# EAGLE design C64_Exp_port (EAGLE 9.6.0)
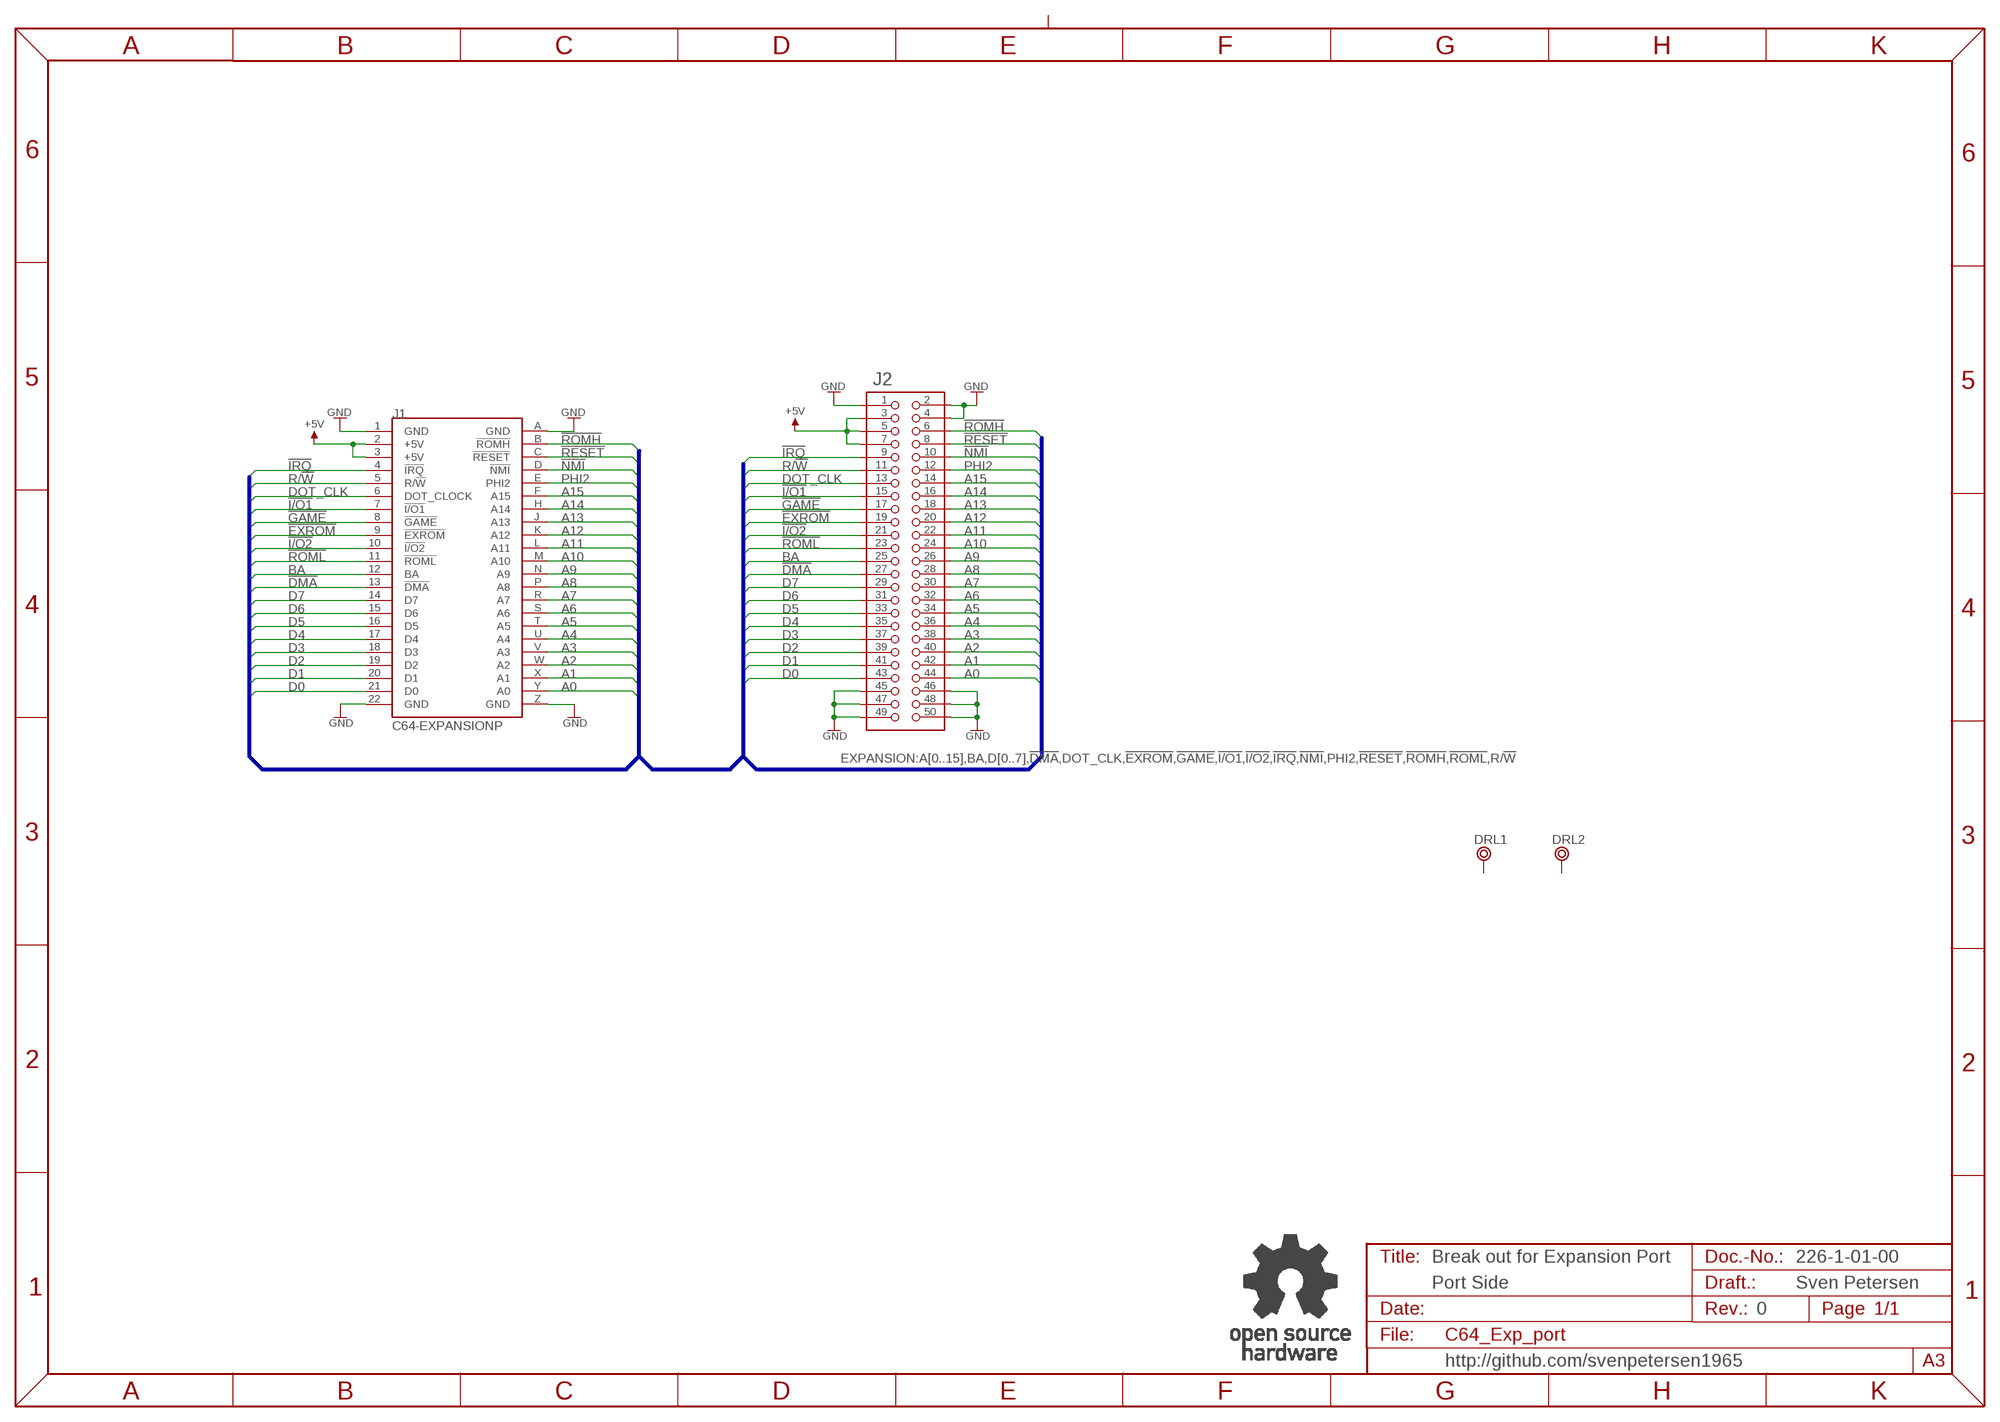
[diagram p0: schematic, sheet 1]

## Parts
DRL1  BOHR3,3  [BOHR3,3]
DRL2  BOHR3,3  [BOHR3,3]
J1  C64-EXPANSIONP  [EXPPORT]
J2  PINHD-2X25BOX  [2X25WV]
U$22  OPEN_SOURCE_HW  [OPENHW]

## Nets
!DMA: J1.13(!DMA) J2.27
!EXROM: J1.9(!EXROM) J2.19
!GAME: J1.8(!GAME) J2.17
!I/O1: J1.7(!I/O1) J2.15
!I/O2: J1.10(!I/O2) J2.21
!IRQ: J1.4(!IRQ) J2.9
!NMI: J1.D(!NMI) J2.10
!RESET: J1.C(!RESET) J2.8
!ROMH: J1.B(!ROMH) J2.6
!ROML: J1.11(!ROML) J2.23
+5V: J1.2(+5V) J1.3(+5V) J2.3 J2.5 J2.7
A0: J1.Y(A0) J2.44
A1: J1.X(A1) J2.42
A2: J1.W(A2) J2.40
A3: J1.V(A3) J2.38
A4: J1.U(A4) J2.36
A5: J1.T(A5) J2.34
A6: J1.S(A6) J2.32
A7: J1.R(A7) J2.30
A8: J1.P(A8) J2.28
A9: J1.N(A9) J2.26
A10: J1.M(A10) J2.24
A11: J1.L(A11) J2.22
A12: J1.K(A12) J2.20
A13: J1.J(A13) J2.18
A14: J1.H(A14) J2.16
A15: J1.F(A15) J2.14
BA: J1.12(BA) J2.25
D0: J1.21(D0) J2.43
D1: J1.20(D1) J2.41
D2: J1.19(D2) J2.39
D3: J1.18(D3) J2.37
D4: J1.17(D4) J2.35
D5: J1.16(D5) J2.33
D6: J1.15(D6) J2.31
D7: J1.14(D7) J2.29
DOT_CLK: J1.6(DOT_CLOCK) J2.13
GND: J1.1(GND) J1.22(GND) J1.A(GND) J1.Z(GND) J2.1 J2.2 J2.4 J2.45 J2.46 J2.47 J2.48 J2.49 J2.50
PHI2: J1.E(PHI2) J2.12
R/!W: J1.5(R/!W) J2.11
Unconnected: DRL1.P$1 DRL2.P$1

## Buses
EXPANSION:A[0..15],BA,D[0..7],!DMA,DOT_CLK,!EXROM,!GAME,!I/O1,!I/O2,!IRQ,!NMI,PHI2,!RESET,!ROMH,!ROML,R/!W

## Notes on the sheet
- Break out for Expansion Port | 226-1-01-00
- Port Side | Sven Petersen
- 0
- http://github.com/svenpetersen1965

## Library data of the parts
DRL1 DRL2 = Mech_Bohr:BOHR3,3
J1 = Commodore:C64-EXPANSIONP
J2 = PINHEAD:PINHD-2X25
U$22 = Logo:OPEN_SOURCE_HW

## Board
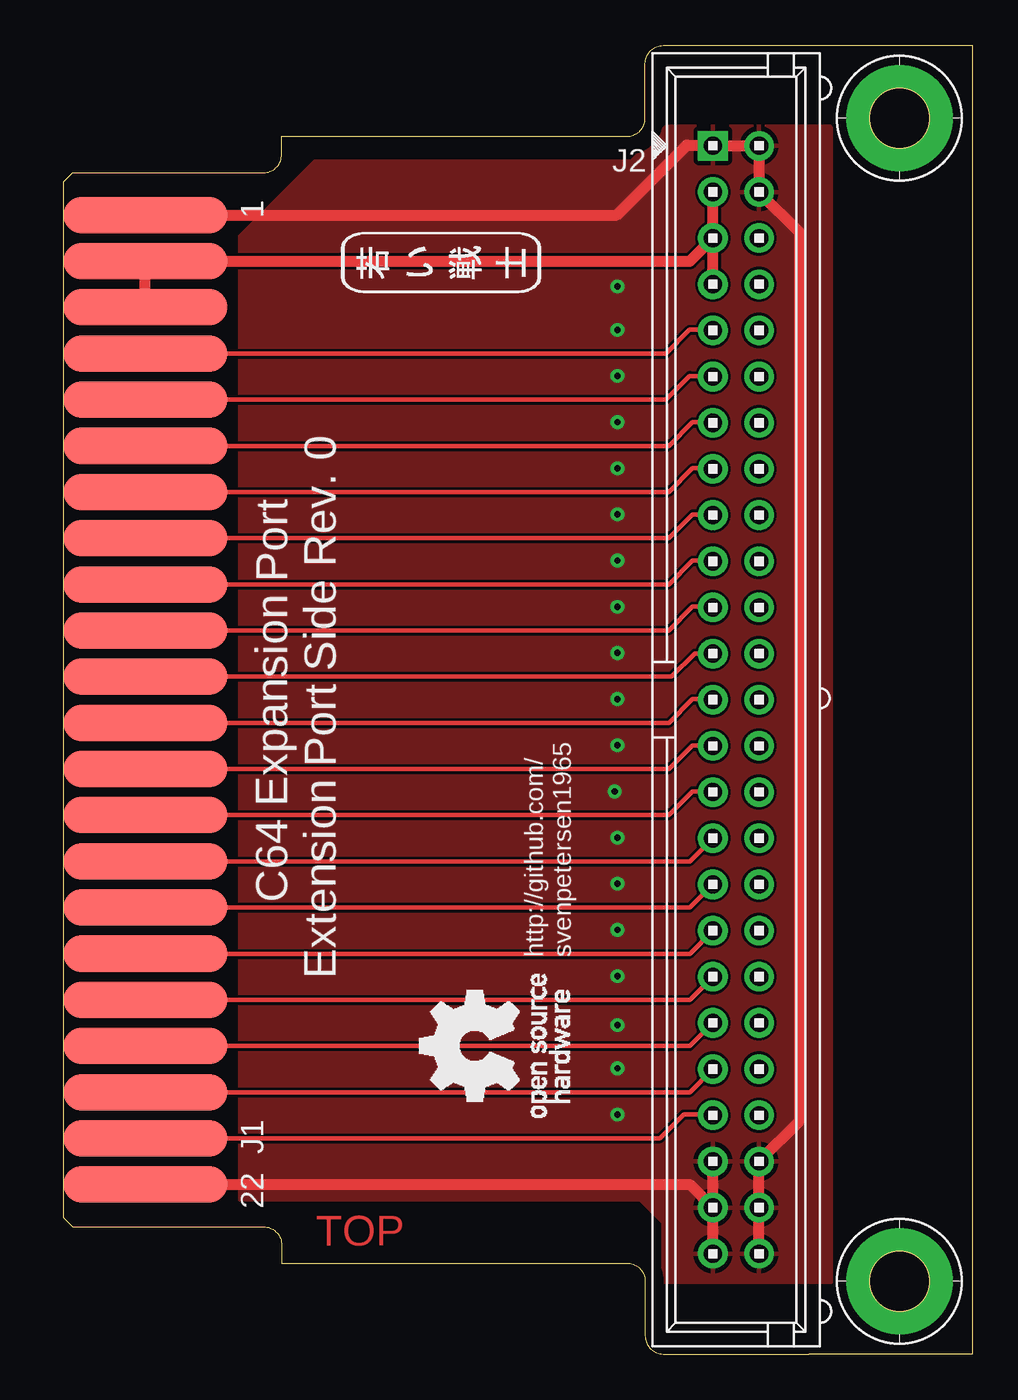
[diagram p1: board, top side]
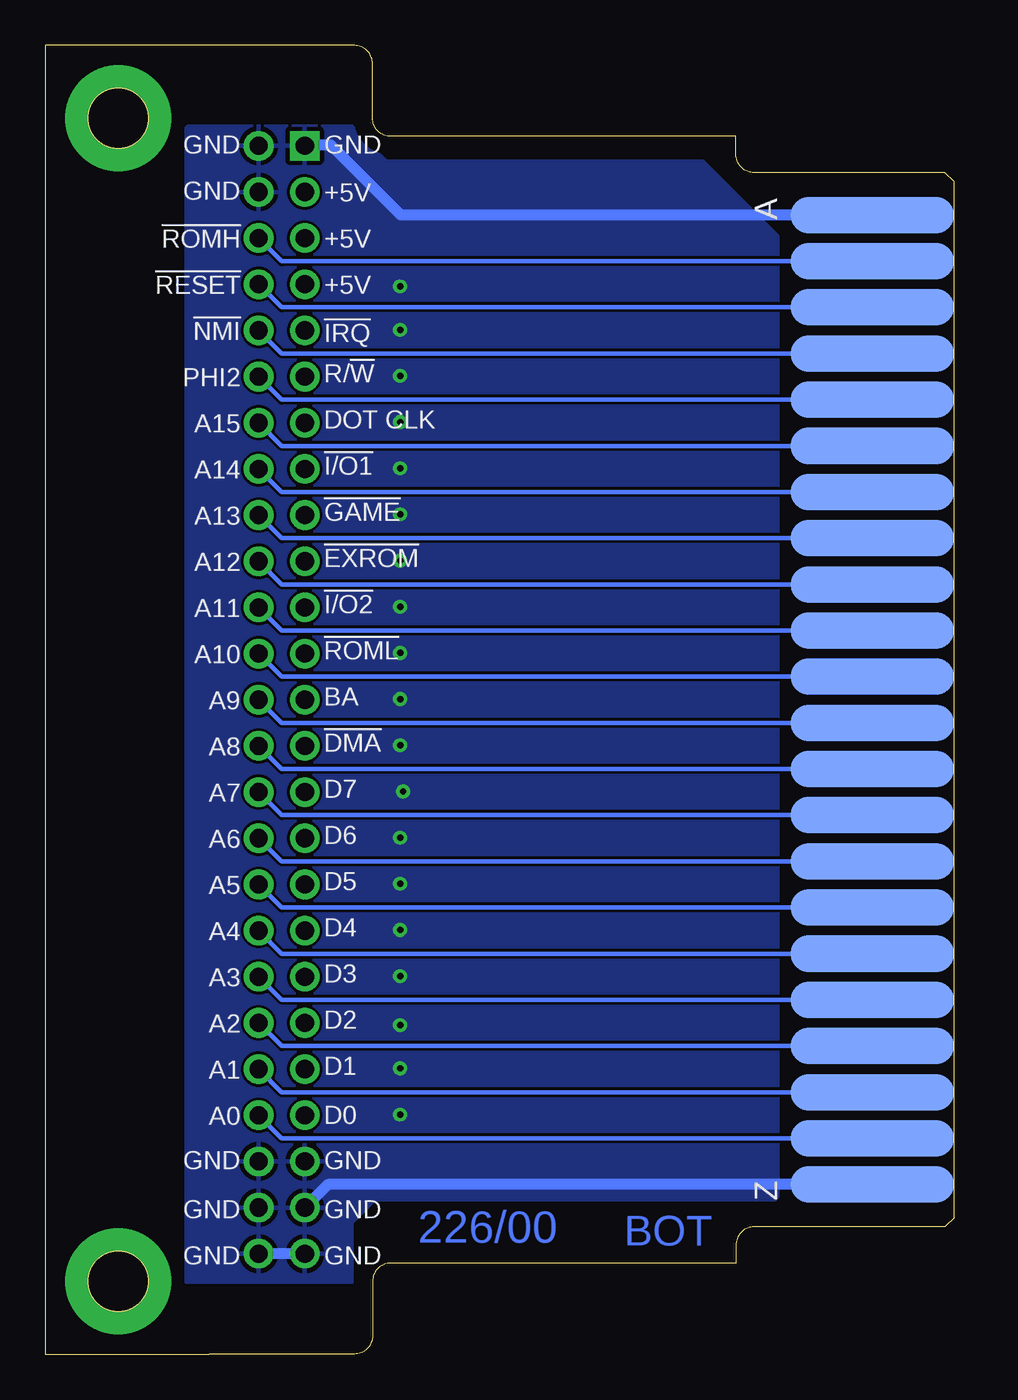
[diagram p2: board, bottom side, seen from below]

Size 50 x 72 mm. Coordinates in mm from the lower left corner, seen from the top.
Outline: 11,7 arc-90 12,6 12,5 31,5 arc-90 32,4 32,1 arc90 33,0 41,0 50,0 50,72 41,72 33,72 arc90 32,71 32,68 arc-90 31,67 12,67 12,66 arc-90 11,65
Copper layers (1*16): Top 0.035mm / dielectric 1.5mm / Bottom 0.035mm
Design rules "default *": minimum track width 6mil, minimum drill 0.35mm, track to track 6mil, track to pad 6mil, pad to pad 6mil, via to via 6mil, smd to smd 6mil, copper to edge 40mil, drill to drill 6mil, minimum pad ring 10mil, minimum via ring 8mil, stop-mask expansion 4mil, vias tented up to drill 25mil, thermal gap 10mil

### Footprints (pad centres in the part's own frame; a part is rotated, then mirrored left to right if it is on the bottom)
BOHR3,3 = drill 3.302 pad 5.842: P$1 0,0
EXPPORT = smd 2 x 9: 1 26.67,-4.5; 2 24.13,-4.5; 3 21.59,-4.5; 4 19.05,-4.5; 5 16.51,-4.5; 6 13.97,-4.5; 7 11.43,-4.5; 8 8.89,-4.5; 9 6.35,-4.5; 10 3.81,-4.5; 11 1.27,-4.5; 12 -1.27,-4.5; 13 -3.81,-4.5; 14 -6.35,-4.5; 15 -8.89,-4.5; 16 -11.43,-4.5; 17 -13.97,-4.5; 18 -16.51,-4.5; 19 -19.05,-4.5; 20 -21.59,-4.5; 21 -24.13,-4.5; 22 -26.67,-4.5 | smd 2 x 9 bottom: A 26.67,-4.5; B 24.13,-4.5; C 21.59,-4.5; D 19.05,-4.5; E 16.51,-4.5; F 13.97,-4.5; H 11.43,-4.5; J 8.89,-4.5; K 6.35,-4.5; L 3.81,-4.5; M 1.27,-4.5; N -1.27,-4.5; P -3.81,-4.5; R -6.35,-4.5; S -8.89,-4.5; T -11.43,-4.5; U -13.97,-4.5; V -16.51,-4.5; W -19.05,-4.5; X -21.59,-4.5; Y -24.13,-4.5; Z -26.67,-4.5
2X25WV = drill 1 pad 1.626 square: 1 -30.48,-1.27 | drill 1 pad 1.626: 2 -30.48,1.27; 3 -27.94,-1.27; 4 -27.94,1.27; 5 -25.4,-1.27; 6 -25.4,1.27; 7 -22.86,-1.27; 8 -22.86,1.27; 9 -20.32,-1.27; 10 -20.32,1.27; 11 -17.78,-1.27; 12 -17.78,1.27; 13 -15.24,-1.27; 14 -15.24,1.27; 15 -12.7,-1.27; 16 -12.7,1.27; 17 -10.16,-1.27; 18 -10.16,1.27; 19 -7.62,-1.27; 20 -7.62,1.27; 21 -5.08,-1.27; 22 -5.08,1.27; 23 -2.54,-1.27; 24 -2.54,1.27; 25 0,-1.27; 26 0,1.27; 27 2.54,-1.27; 28 2.54,1.27; 29 5.08,-1.27; 30 5.08,1.27; 31 7.62,-1.27; 32 7.62,1.27; 33 10.16,-1.27; 34 10.16,1.27; 35 12.7,-1.27; 36 12.7,1.27; 37 15.24,-1.27; 38 15.24,1.27; 39 17.78,-1.27; 40 17.78,1.27; 41 20.32,-1.27; 42 20.32,1.27; 43 22.86,-1.27; 44 22.86,1.27; 45 25.4,-1.27; 46 25.4,1.27; 47 27.94,-1.27; 48 27.94,1.27; 49 30.48,-1.27; 50 30.48,1.27

### Placement (x,y rotation side)
DRL1  46,68 0 top
DRL2  46,4 0 top
J1  0,36 90 top
J2  37,36 270 top
U$20  [2LAYER]  13.88,5.95 0 top
U$21  [PCB-TITLE/]  0,78.74 0 top  (outside the outline)
U$22  27.85,13.02 90 top
U$23  [SVEN_TAG]  20.66,60.09 90 top

### Tracks (layer width: path | path; a pad name or v marks a point on that pad's centre or on a via)
!DMA
  Top 0.254: J1.13 33.3,32.19 34.61,33.5 35.69,33.5 J2.27
!EXROM
  Top 0.254: J1.9 33.3,42.35 34.61,43.66 35.69,43.66 J2.19
!GAME
  Top 0.254: J1.8 33.3,44.89 34.61,46.2 35.69,46.2 J2.17
!I/O1
  Top 0.254: J1.7 33.3,47.43 34.61,48.74 35.69,48.74 J2.15
!I/O2
  Top 0.254: J1.10 33.3,39.81 34.61,41.12 35.69,41.12 J2.21
!IRQ
  Top 0.254: J1.4 33.14,55.05 34.45,56.36 35.69,56.36 J2.9
!NMI
  Bottom 0.254: J1.D 37,55.05 J2.10
!RESET
  Bottom 0.254: J1.C 37,57.59 J2.8
!ROMH
  Bottom 0.254: J1.B 37,60.13 J2.6
!ROML
  Top 0.254: J1.11 33.46,37.27 34.73,38.54 J2.23
+5V
  Top 0.61: J2.5 34.46,60.13 J1.2 J1.3 | J2.5 J2.3 | J2.7 J2.5
A0
  Bottom 0.254: J1.Y 37,11.87 J2.44
A1
  Bottom 0.254: J1.X 37,14.41 J2.42
A2
  Bottom 0.254: J1.W 37,16.95 J2.40
A3
  Bottom 0.254: J1.V 37,19.49 J2.38
A4
  Bottom 0.254: J1.U 37,22.03 J2.36
A5
  Bottom 0.254: J1.T 37,24.57 J2.34
A6
  Bottom 0.254: J1.S 37,27.11 J2.32
A7
  Bottom 0.254: J1.R 37,29.65 J2.30
A8
  Bottom 0.254: J1.P 37,32.19 J2.28
A9
  Bottom 0.254: J1.N 37,34.73 J2.26
A10
  Bottom 0.254: J1.M 37,37.27 J2.24
A11
  Bottom 0.254: J1.L 37,39.81 J2.22
A12
  Bottom 0.254: J1.K 37,42.35 J2.20
A13
  Bottom 0.254: J1.J 37,44.89 J2.18
A14
  Bottom 0.254: J1.H 37,47.43 J2.16
A15
  Bottom 0.254: J1.F 37,49.97 J2.14
BA
  Top 0.254: J1.12 33.3,34.73 34.61,36.04 35.69,36.04 J2.25
D0
  Top 0.152: 35.69,13.18 J2.43
  Top 0.254: J1.21 32.83,11.87 34.13,13.18 35.69,13.18
D1
  Top 0.254: J1.20 34.46,14.41 J2.41
D2
  Top 0.254: J1.19 34.46,16.95 J2.39
D3
  Top 0.254: J1.18 34.46,19.49 J2.37
D4
  Top 0.254: J1.17 34.46,22.03 J2.35
D5
  Top 0.254: J1.16 34.46,24.57 J2.33
D6
  Top 0.254: J1.15 34.46,27.11 J2.31
D7
  Top 0.254: J1.14 33.3,29.65 34.61,30.96 35.69,30.96 J2.29
DOT_CLK
  Top 0.254: J1.6 33.3,49.97 34.61,51.28 35.69,51.28 J2.13
GND  (via drill 0.35)
  Top 0.61: J1.A 30.44,62.67 34.29,66.52 35.69,66.52 J2.1 J2.2 J2.4 40.48,61.73 40.48,12.81 J2.46 J2.48 J2.50 | J1.Z 34.46,9.33 J2.47 | J2.47 J2.45 | J2.49 J2.47
  Bottom 0.61: J2.49 J2.50 | J1.A 30.44,62.67 34.29,66.52 35.69,66.52 J2.1 | J1.Z 34.46,9.33 J2.47
  other vias: 30.48,13.18 30.48,15.72 30.48,18.1 30.48,20.8 30.48,23.34 30.48,25.88 30.48,28.42 30.32,30.96 30.48,33.5 30.48,36.04 30.48,38.58 30.48,41.12 30.48,43.66 30.48,46.2 30.48,48.74 30.48,51.28 30.48,53.82 30.48,56.36 30.48,58.74
  pour Bottom: 9.68,61.52 13.81,65.64 31.23,65.64 33.13,67.55 42.18,67.55 42.25,67.48 42.25,3.95 33.13,3.95 33.13,7.22 31.86,8.49 9.84,8.49 9.68,8.65
  pour Top: 13.81,65.64 31.23,65.64 33.13,67.55 42.18,67.55 42.25,67.48 42.25,3.95 32.97,3.95 32.97,7.22 31.7,8.49 9.68,8.49 9.68,61.52
PHI2
  Bottom 0.254: J1.E 37,52.51 J2.12
R/!W
  Top 0.254: J1.5 33.14,52.51 34.45,53.82 35.69,53.82 J2.11

### Text on the board
Bottom: 226/00
tPlace: C64 Expansion Port / Extension Port Side Rev. 0 | http://github.com/ / svenpetersen1965
bPlace: GND | GND | +5V | GND | +5V | !ROMH | +5V | !RESET | !IRQ | !NMI | R/!W | PHI2 | DOT CLK | A15 | !I/O1 | A14 | !GAME | A13 | !EXROM | A12 | !I/O2 | A11 | !ROML | A10 | BA | A9 | !DMA | A8 | D7 | A7 | D6 | A6 | D5 | A5 | D4 | A4 | D3 | A3 | D2 | A2 | D1 | A1 | D0 | A0 | GND | GND | GND | GND | GND | GND
Document: Sven Petersen | 226-2-01-00 | 2026 | 35µm | 2 | 0